# Altium schematic sheet motor driver 2.SchDoc
size A4; SheetNumber: 6; SheetTotal: 9
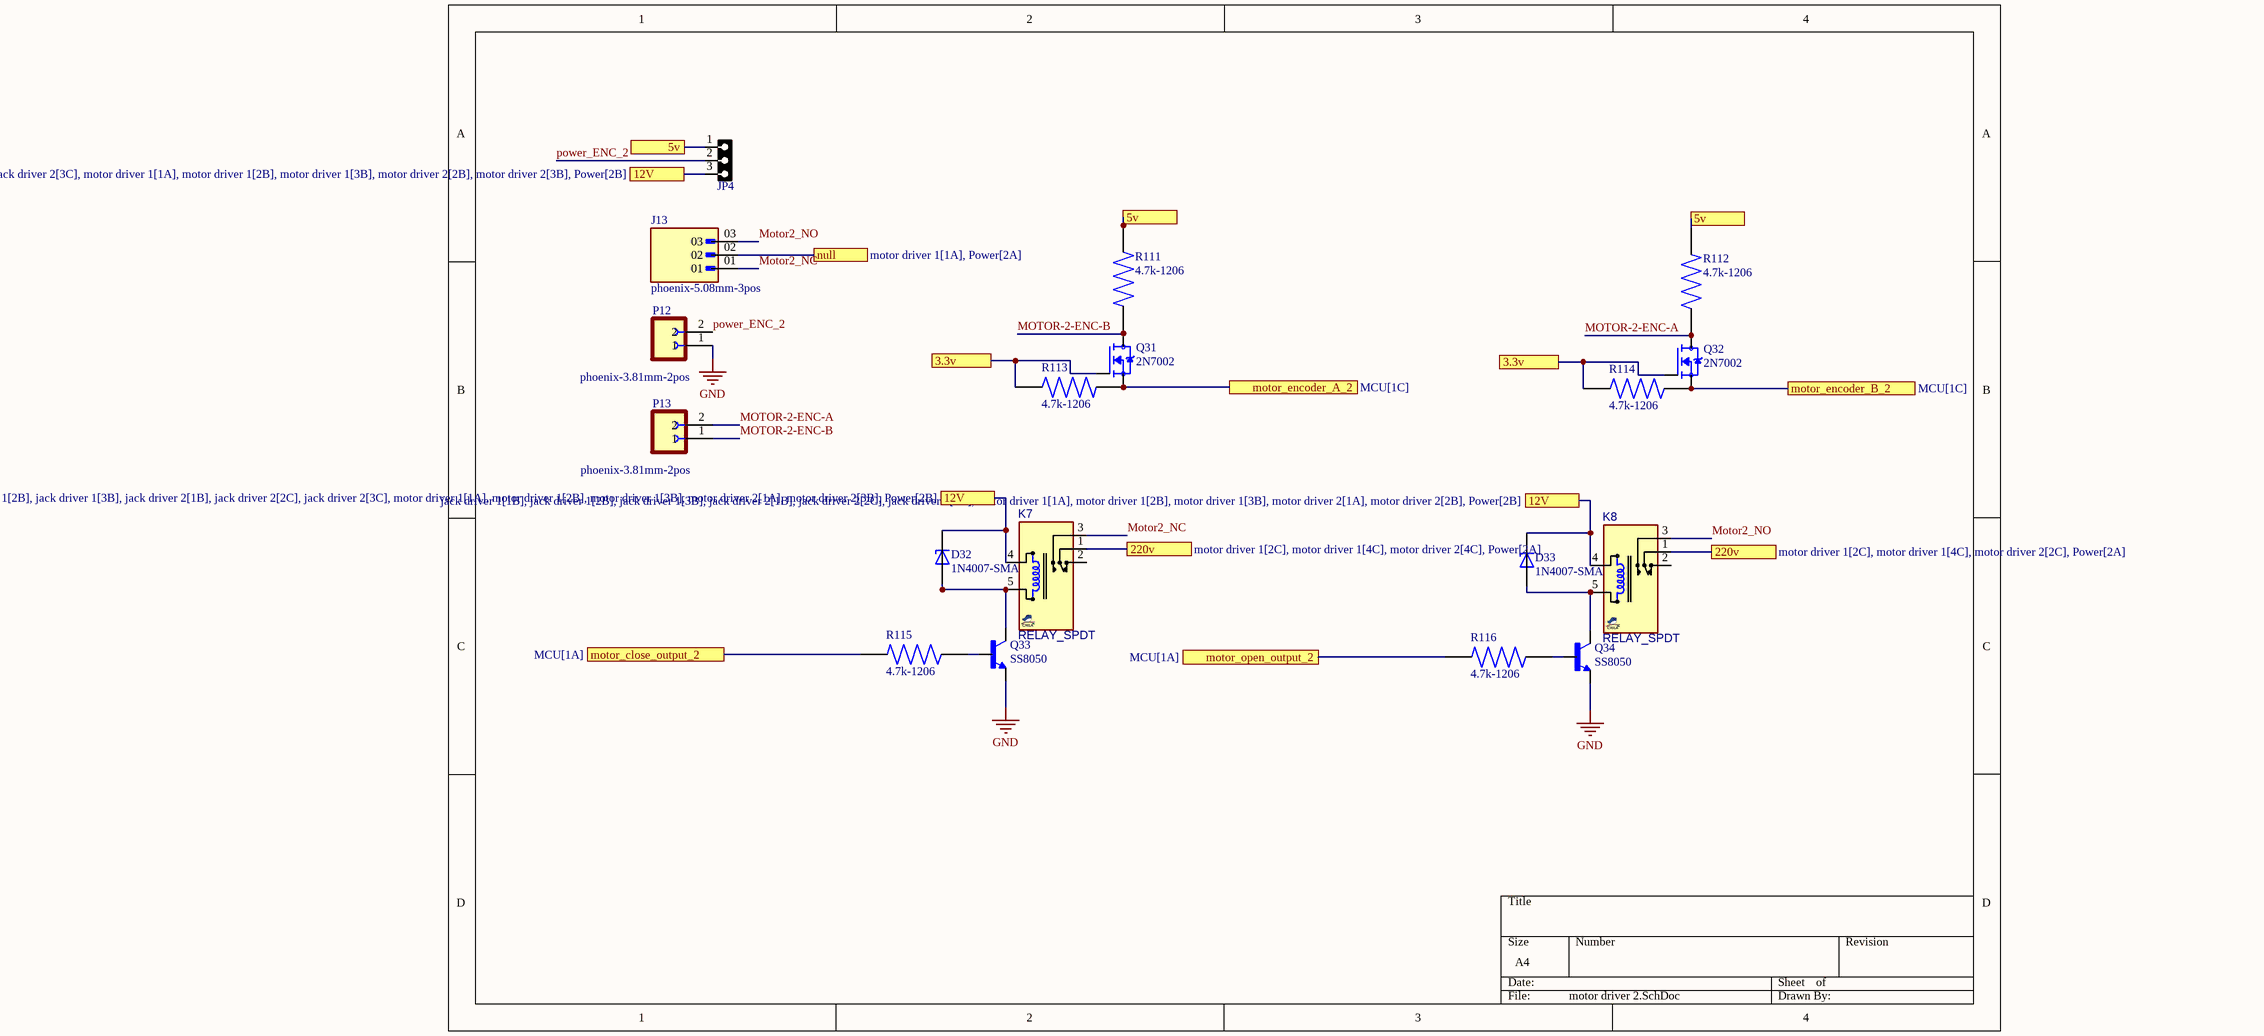
[diagram p0: motor driver 2.SchDoc]

## Parts
D32  1N4007-SMA  [DIOM4325X250N]
D33  1N4007-SMA  [DIOM4325X250N]
J13  phoenix-5.08mm-3pos  [PHOENIX_1759020]
JP4  HDRF3  [HDRLP_F_1X3]  (value not drawn)
K7  RELAY_SPDT  [REL_SPDT_5_1512]
K8  RELAY_SPDT  [REL_SPDT_5_1512]
P12  phoenix-3.81mm-2pos  [PHOENIX_1803578]
P13  phoenix-3.81mm-2pos  [PHOENIX_1803578]
Q31  2N7002  [SOT95P240X111-3N]
Q32  2N7002  [SOT95P240X111-3N]
Q33  SS8050  [TRANS_SS8050-G]
Q34  SS8050  [TRANS_SS8050-G]
R111  4.7k-1206  [RESC3015X65N]
R112  4.7k-1206  [RESC3015X65N]
R113  4.7k-1206  [RESC3015X65N]
R114  4.7k-1206  [RESC3015X65N]
R115  4.7k-1206  [RESC3015X65N]
R116  4.7k-1206  [RESC3015X65N]

## Ports
3.3v (see interface[1D], interface[3C], jack driver 1[2A], jack driver 1[3B], jack driver 2[2A], jack driver 2[3B], motor driver 1[2B], motor driver 1[3B], motor driver 2[2B], Power[2D], receiver 1[2A], receiver 1[2C], receiver 1[4A], receiver 1[4C], receiver 2[2A], receiver 2[2C], receiver 2[4A], receiver 2[4C]), 3.3v (see interface[1D], interface[3C], jack driver 1[2A], jack driver 1[3B], jack driver 2[2A], jack driver 2[3B], motor driver 1[2B], motor driver 1[3B], motor driver 2[3B], Power[2D], receiver 1[2A], receiver 1[2C], receiver 1[4A], receiver 1[4C], receiver 2[2A], receiver 2[2C], receiver 2[4A], receiver 2[4C]), 5v (see interface[1A], interface[1B], interface[1D], interface[2A], interface[2B], interface[2D], interface[3A], interface[3B], interface[4A], interface[4B], jack driver 1[1B], jack driver 1[2A], jack driver 1[4A], jack driver 2[1B], jack driver 2[2A], jack driver 2[4A], MCU[1A], motor driver 1[1A], motor driver 1[2A], motor driver 1[4A], motor driver 2[1A], motor driver 2[2A], Power[2C]), 5v (see interface[1A], interface[1B], interface[1D], interface[2A], interface[2B], interface[2D], interface[3A], interface[3B], interface[4A], interface[4B], jack driver 1[1B], jack driver 1[2A], jack driver 1[4A], jack driver 2[1B], jack driver 2[2A], jack driver 2[4A], MCU[1A], motor driver 1[1A], motor driver 1[2A], motor driver 1[4A], motor driver 2[1A], motor driver 2[4A], Power[2C]), 5v (see interface[1A], interface[1B], interface[1D], interface[2A], interface[2B], interface[2D], interface[3A], interface[3B], interface[4A], interface[4B], jack driver 1[1B], jack driver 1[2A], jack driver 1[4A], jack driver 2[1B], jack driver 2[2A], jack driver 2[4A], MCU[1A], motor driver 1[1A], motor driver 1[2A], motor driver 1[4A], motor driver 2[2A], motor driver 2[4A], Power[2C]), 12V (see jack driver 1[1B], jack driver 1[2B], jack driver 1[3B], jack driver 2[1B], jack driver 2[2C], jack driver 2[3C], motor driver 1[1A], motor driver 1[2B], motor driver 1[3B], motor driver 2[1A], motor driver 2[2B], Power[2B]), 12V (see jack driver 1[1B], jack driver 1[2B], jack driver 1[3B], jack driver 2[1B], jack driver 2[2C], jack driver 2[3C], motor driver 1[1A], motor driver 1[2B], motor driver 1[3B], motor driver 2[1A], motor driver 2[3B], Power[2B]), 12V (see jack driver 1[1B], jack driver 1[2B], jack driver 1[3B], jack driver 2[1B], jack driver 2[2C], jack driver 2[3C], motor driver 1[1A], motor driver 1[2B], motor driver 1[3B], motor driver 2[2B], motor driver 2[3B], Power[2B]), 220v (see motor driver 1[2C], motor driver 1[4C], motor driver 2[2C], Power[2A]), 220v (see motor driver 1[2C], motor driver 1[4C], motor driver 2[4C], Power[2A]), motor_close_output_2 (see MCU[1A]), motor_encoder_A_2 (see MCU[1C]), motor_encoder_B_2 (see MCU[1C]), motor_open_output_2 (see MCU[1A]), null (see motor driver 1[1A], Power[2A])

## Nets
GND: P12.1 Q33.2(E) Q34.2(E)
3.3v: Q31.1(G) Q32.1(G) R113.2 R114.2 ; port 3.3v
5v: JP4.1 R111.2 R112.2 ; port 5v
12V: D32.C D33.C JP4.3 K7.4(T1) K8.4(T1) ; port 12V
220v: K7.1(COM) K8.1(COM) ; port 220v
Motor2_NC: J13.01 K7.3(NO)
Motor2_NO: J13.03 K8.3(NO)
MOTOR-2-ENC-A: P13.2 Q32.3(D) R112.1
MOTOR-2-ENC-B: P13.1 Q31.3(D) R111.1
motor_close_output_2: R115.2 ; port motor_close_output_2
motor_encoder_A_2: Q31.2(S) R113.1 ; port motor_encoder_A_2
motor_encoder_B_2: Q32.2(S) R114.1 ; port motor_encoder_B_2
motor_open_output_2: R116.2 ; port motor_open_output_2
null: J13.02 ; port null
power_ENC_2: JP4.2 P12.2
NetD32_A: D32.A K7.5(T2) Q33.3(C)
NetD33_A: D33.A K8.5(T2) Q34.3(C)
NetQ33_1: Q33.1(B) R115.1
NetQ34_1: Q34.1(B) R116.1

Not connected (* = marked no-connect by the designer): K7 2(NC); K8 2(NC)

## Library data of the parts
D32 D33 = SMAJ26A: 400W, 30.4V, 5%, Unidirectional, TVS; MF: Taiwan Semiconductor; SnapEDA_Link: https://www.snapeda.com/parts/SMAJ26A/taiwan/view-part/?ref=snap; Package: SMA-2 Taiwan Semiconductor; Value: *; MP: SMAJ26A; Check_prices: https://www.snapeda.com/parts/SMAJ26A/taiwan/view-part/?ref=eda
J13 = 1759020: Pluggable Header 5.08mm 12AWG 320V 12A 3 Position COMBICON MSTB Series | Phoenix Contact 1759020; SnapEDA_Link: https://www.snapeda.com/parts/1759020/Phoenix+Contact/view-part/?ref=snap; Package: None; Value: *; MF: Phoenix Contact; MP: 1759020; Check_prices: https://www.snapeda.com/parts/1759020/Phoenix+Contact/view-part/?ref=eda
JP4 = HDRLP_F_1X3: CONN, HEADER, Male, pitch: 2.54mm, 3POS; VALUE: HDRF3
K7 K8 = RELAY_SPDT_5_1512_G8QN: Relay, SPDT, 5P, 15.4X12.1mm, 16V/30A; MANF: OMRON; MANF_P#: G8QN-1C4 DC12; PARAM2: 16VDC, 30A; PARAM: 12V, 50mA; PRICE: PRICE; Value: RELAY_SPDT
P12 P13 = 1803578: 2 Position Terminal Block Plug, Female Sockets 0.150 (3.81mm) 180Â° Free Hanging (In-Line); MF: Phoenix Contact; Price: None; Purchase-URL: https://pricing.snapeda.com/search/part/1803578/?ref=eda; Availability: Good; SnapEDA_Link: https://www.snapeda.com/parts/1803578/Phoenix%20Contact/view-part/46882/?ref=snap; MP: 1803578; Value: *; Check_prices: https://www.snapeda.com/parts/1803578/Phoenix%20Contact/view-part/46882/?ref=eda; Package: Custom Package Phoenix Contact
Q31 Q32 = 2N7002: N-Channel 60V 280mA (Ta) 350mW (Ta) Surface Mount SOT-23-3 (TO-236); MF: {'manufacturer': u'onsemi'}; Package: None; Price: None; Value: *; MP: 2N7002; Availability: Unavailable
Q33 Q34 = SS8050-G: Bipolar (BJT) Transistor NPN 25 V 1.5 A 100MHz 300 mW Surface Mount SOT-23-3; MP: SS8050G; MF: Comchip; Digi-Key_Part_Number: 641-1790-2-ND; Check_prices: https://www.snapeda.com/parts/SS8050G/Comchip/view-part/?ref=eda; Package: None; SnapEDA_Link: https://www.snapeda.com/parts/SS8050G/Comchip/view-part/?ref=snap; Value: *
R111-R116 = CPF1206B10KE1: Res Thin Film 1206 10K Ohm 0.1% 1/8W Â±25ppm/Â°C Molded SMD SMD Paper T/R; Power_Rating: .125 W; MF: TE Connectivity; Voltage_Rating: 150 V; Tolerance: .1%; SnapEDA_Link: https://www.snapeda.com/parts/CPF1206B10KE1/TE+Connectivity/view-part/?ref=snap; Package: 1206; Resistance: 10K; Value: *; MP: CPF1206B10KE1; EU_RoHS_Compliance: Compliant; Check_prices: https://www.snapeda.com/parts/CPF1206B10KE1/TE+Connectivity/view-part/?ref=eda